# Altium schematic sheet Analog_adacus_sch.SchDoc
size B; SheetNumber: 4; SheetTotal: 4
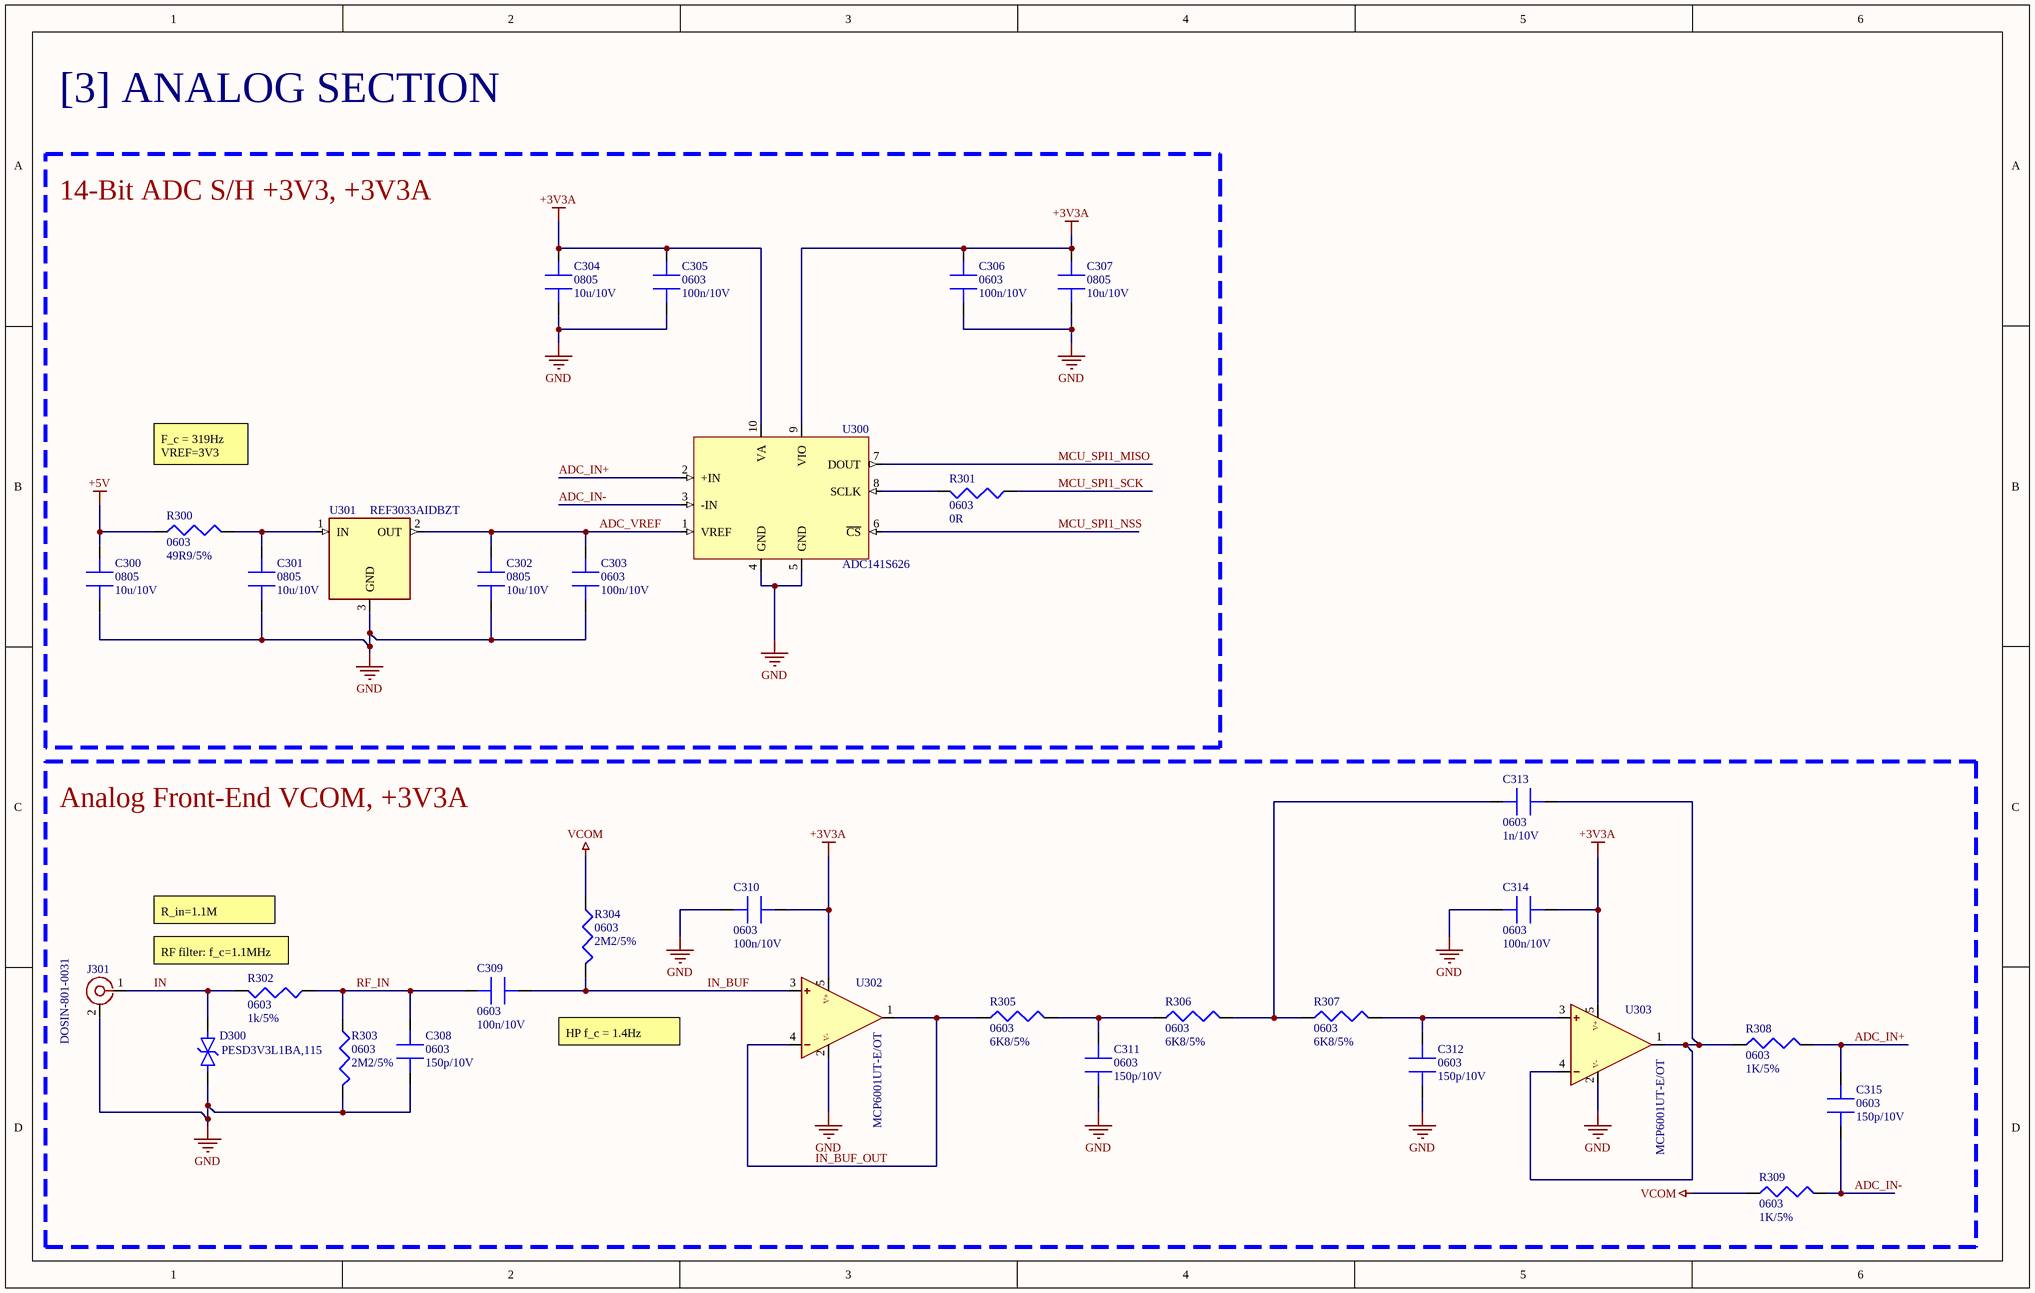
[diagram p0: Analog_adacus_sch.SchDoc]

## Parts
C300  value 10u/10V  Package: 0805  [[0805] CAPC2012X09M [A - LD]]  (hidden comment: Capacitor)
C301  value 10u/10V  Package: 0805  [[0805] CAPC2012X09M [A - LD]]  (hidden comment: Capacitor)
C302  value 10u/10V  Package: 0805  [[0805] CAPC2012X09M [A - LD]]  (hidden comment: Capacitor)
C303  value 100n/10V  Package: 0603  [[0603] CAPC1608X10M [A-LD]]  (hidden comment: Capacitor)
C304  value 10u/10V  Package: 0805  [[0805] CAPC2012X09M [A - LD]]  (hidden comment: Capacitor)
C305  value 100n/10V  Package: 0603  [[0603] CAPC1608X10M [A-LD]]  (hidden comment: Capacitor)
C306  value 100n/10V  Package: 0603  [[0603] CAPC1608X10M [A-LD]]  (hidden comment: Capacitor)
C307  value 10u/10V  Package: 0805  [[0805] CAPC2012X09M [A - LD]]  (hidden comment: Capacitor)
C308  value 150p/10V  Package: 0603  [[0603] CAPC1608X10M [A-LD]]  (hidden comment: Capacitor)
C309  value 100n/10V  Package: 0603  [[0603] CAPC1608X10M [A-LD]]  (hidden comment: Capacitor)
C310  value 100n/10V  Package: 0603  [[0603] CAPC1608X10M [A-LD]]  (hidden comment: Capacitor)
C311  value 150p/10V  Package: 0603  [[0603] CAPC1608X10M [A-LD]]  (hidden comment: Capacitor)
C312  value 150p/10V  Package: 0603  [[0603] CAPC1608X10M [A-LD]]  (hidden comment: Capacitor)
C313  value 1n/10V  Package: 0603  [[0603] CAPC1608X10M [A-LD]]  (hidden comment: Capacitor)
C314  value 100n/10V  Package: 0603  [[0603] CAPC1608X10M [A-LD]]  (hidden comment: Capacitor)
C315  value 150p/10V  Package: 0603  [[0603] CAPC1608X10M [A-LD]]  (hidden comment: Capacitor)
D300  PESD3V3L1BA,115  [SODFL250X110-2M]
J301  DOSIN-801-0031  [DOSIN8010031]
R300  value 49R9/5%  Package: 0603  [[0603] RESC1608X06M [A-LD]]  (hidden comment: Resistor)
R301  value 0R  Package: 0603  [[0603] RESC1608X06M [A-LD]]  (hidden comment: Resistor)
R302  value 1k/5%  Package: 0603  [[0603] RESC1608X06M [A-LD]]  (hidden comment: Resistor)
R303  value 2M2/5%  Package: 0603  [[0603] RESC1608X06M [A-LD]]  (hidden comment: Resistor)
R304  value 2M2/5%  Package: 0603  [[0603] RESC1608X06M [A-LD]]  (hidden comment: Resistor)
R305  value 6K8/5%  Package: 0603  [[0603] RESC1608X06M [A-LD]]  (hidden comment: Resistor)
R306  value 6K8/5%  Package: 0603  [[0603] RESC1608X06M [A-LD]]  (hidden comment: Resistor)
R307  value 6K8/5%  Package: 0603  [[0603] RESC1608X06M [A-LD]]  (hidden comment: Resistor)
R308  value 1K/5%  Package: 0603  [[0603] RESC1608X06M [A-LD]]  (hidden comment: Resistor)
R309  value 1K/5%  Package: 0603  [[0603] RESC1608X06M [A-LD]]  (hidden comment: Resistor)
U300  ADC141S626  [TSSOP50P490X110-10M]
U301  REF3033AIDBZT  [SOT95P237X112-3M]
U302  MCP6001UT-E/OT  [SOT95P270X145-5M]
U303  MCP6001UT-E/OT  [SOT95P270X145-5M]

## Blocks framed on the sheet
14-Bit ADC S/H +3V3, +3V3A: C300-C307 R300 R301 U300 U301
Analog Front-End VCOM, +3V3A: C308-C315 D300 J301 R302-R309 U302 U303

## Nets
+3V3A: C304.2 C305.2 C306.2 C307.2 C310.1 C314.1 U300.9(VIO) U300.10(VA) U302.5(VDD) U303.5(VDD)
+5V: C300.2 R300.2
GND: C300.1 C301.1 C302.1 C303.1 C304.1 C305.1 C306.1 C307.1 C308.1 C310.2 C311.1 C312.1 C314.2 D300.1 J301.2 R303.1 U300.4(GND) U300.5(GND) U301.3(GND) U302.2(VSS) U303.2(VSS)
VCOM: R304.2 R309.2
ADC_IN+: C315.2 R308.1 U300.2(+IN)
ADC_IN-: C315.1 R309.1 U300.3(-IN)
ADC_VREF: C302.2 C303.2 U300.1(VREF) U301.2(OUT)
IN: D300.2 J301.1 R302.1
IN_BUF: C309.1 R304.1 U302.3(+)
IN_BUF_OUT: R305.2 U302.1(OUT) U302.4(-)
MCU_SPI1_MISO: U300.7(DOUT)
MCU_SPI1_NSS: U300.6(~{CS})
MCU_SPI1_SCK: R301.2
RF_IN: C308.2 C309.2 R302.2 R303.2
NetC301_2: C301.2 R300.1 U301.1(IN)
NetC311_2: C311.2 R305.1 R306.2
NetC312_2: C312.2 R307.1 U303.3(+)
NetC313_1: C313.1 R308.2 U303.1(OUT) U303.4(-)
NetC313_2: C313.2 R306.1 R307.2
NetR301_1: R301.1 U300.8(SCLK)

## Notes on the sheet
- [3] ANALOG SECTION
- F_c = 319Hz VREF=3V3
- R_in=1.1M
- (near R302) RF filter: f_c=1.1MHz
- HP f_c = 1.4Hz
- (in symbol MCP6001UT-E/OT) V+; V-

## Library data of the parts
C300-C315 = Capacitor: Standard Capacitor
D300 = PESD3V3L1BA,115: ESD Suppressors / TVS Diodes PESD3V3L1BA/SOD323/SOD2; Supplier Link: https://www.mouser.pl/ProductDetail/Nexperia/PESD3V3L1BA115?qs=LOCUfHb8d9tfcQwAsqvzKg%3D%3D; Datasheet: https://www.mouser.pl/datasheet/2/916/PESD3V3L1BA-3162553.pdf
J301 = BNC Connector: BNC Board Edge Bend 9.6mm Plugin RF Connectors / Coaxial Connectors
R300-R309 = Resistor: Standard Resistor
U300 = ADC141S626: Analog to Digital Converters - ADC 14-Bit, 50kSPS to 250kSPS, Differential Input, Micro Power ADC 10-VSSOP -40 to 85; Supplier Link: https://www.mouser.pl/ProductDetail/Texas-Instruments/ADC141S626CIMM-NOPB?qs=7X5t%252BdzoRHCk2zqpP70%252BpA%3D%3D&_gl=1*rx7evx*_ga*dW5kZWZpbmVk*_ga_15W4STQT4T*dW5kZWZpbmVk*_ga_1KQLCYKRX3*dW5kZWZpbmVk; Datasheet: https://www.ti.com/lit/ds/symlink/adc141s626.pdf?HQS=dis-mous-null-mousermode-dsf-pf-null-wwe&ts=1699301010266&ref_url=https%253A%252F%252Fwww.mouser.pl%252F
U301 = REF3033AIDBZT: Voltage References 3.3V 50ppm/DegC 50uA SOT23-3 Series; Supplier link: https://www.mouser.pl/ProductDetail/Texas-Instruments/REF3033AIDBZT?qs=sSOk4GDDv7wh24Ty1I7PAw%3D%3D; Datasheet: https://www.ti.com/lit/ds/symlink/ref3030.pdf?HQS=dis-mous-null-mousermode-dsf-pf-null-wwe&ts=1699288831021&ref_url=https%253A%252F%252Feu.mouser.com%252F
U302 U303 = MCP6001UT-E/OT: Operational Amplifiers - Op Amps Single 1.8V 1MHz; Supplier: https://eu.mouser.com/ProductDetail/Microchip-Technology/MCP6001UT-I-OT?qs=Sez7gRs8XSU2iw24kVuIOw%3D%3D; Datasheet: https://eu.mouser.com/datasheet/2/268/MCHP_S_A0009381759_1-2520804.pdf